# Altium schematic sheet Power_supplies_V2.SchDoc
size A4
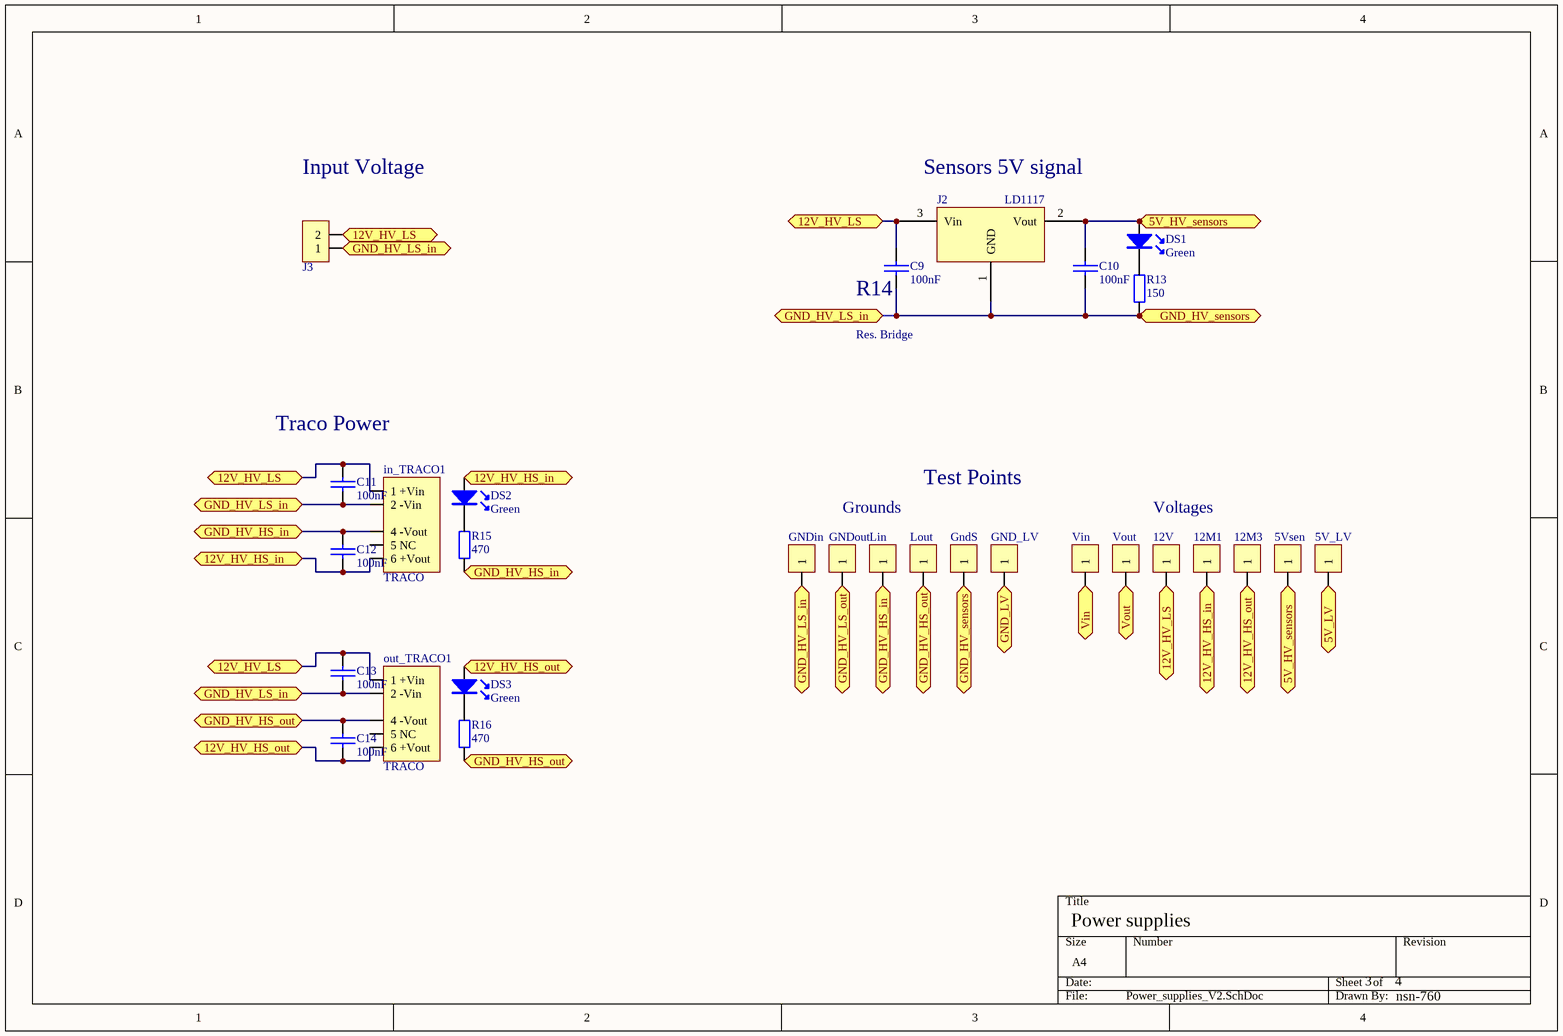
[diagram p0: Power_supplies_V2.SchDoc]

## Parts
5V_LV  Test Point  [Test_Point]  (value not drawn)
5Vsen  Test Point  [Test_Point]  (value not drawn)
12M1  Test Point  [Test_Point]  (value not drawn)
12M3  Test Point  [Test_Point]  (value not drawn)
12V  Test Point  [Test_Point]  (value not drawn)
C9  100nF  [1206]
C10  100nF  [1206]
C11  100nF  [1206]
C12  100nF  [1206]
C13  100nF  [1206]
C14  100nF  [1206]
DS1  Green  [Led 2.2mm]
DS2  Green  [Led 2.2mm]
DS3  Green  [Led 2.2mm]
GND_LV  Test Point  [Test_Point]  (value not drawn)
GNDin  Test Point  [Test_Point]  (value not drawn)
GNDout  Test Point  [Test_Point]  (value not drawn)
GndS  Test Point  [Test_Point]  (value not drawn)
in_TRACO1  TRACO  [TRACO_TMA1212S]
J2  LD1117  [SOT-223_LM1117]
J3  Cleva 2 vias  [Con2_Extron _3.5mmPitch]  (value not drawn)
Lin  Test Point  [Test_Point]  (value not drawn)
Lout  Test Point  [Test_Point]  (value not drawn)
out_TRACO1  TRACO  [TRACO_TMA1212S]
R13  150  [1206]
R14  Res. Bridge  [1206]
R15  470  [1206]
R16  470  [1206]
Vin  Test Point  [Test_Point]  (value not drawn)
Vout  Test Point  [Test_Point]  (value not drawn)

## Ports
5V_HV_sensors, 5V_LV, 12V_HV_HS_in, 12V_HV_HS_out, 12V_HV_LS, GND_HV_HS_in, GND_HV_HS_out, GND_HV_LS_in, GND_HV_LS_out, GND_HV_sensors, GND_LV, Vin, Vout

## Nets
5V_HV_sensors: 5Vsen.1 C10.2 DS1.A J2.2(Vout) ; port 5V_HV_sensors
5V_LV: 5V_LV.1 ; port 5V_LV
12V_HV_HS_in: 12M1.1 C12.1 DS2.A in_TRACO1.6(6_+Vout) ; port 12V_HV_HS_in
12V_HV_HS_out: 12M3.1 C14.1 DS3.A out_TRACO1.6(6_+Vout) ; port 12V_HV_HS_out
12V_HV_LS: 12V.1 C9.2 C11.2 C13.2 in_TRACO1.1(1_+Vin) J2.3(Vin) J3.2 out_TRACO1.1(1_+Vin) ; port 12V_HV_LS
GND_HV_HS_in: C12.2 in_TRACO1.4(4_-Vout) Lin.1 R15.2 ; port GND_HV_HS_in
GND_HV_HS_out: C14.2 Lout.1 out_TRACO1.4(4_-Vout) R16.2 ; port GND_HV_HS_out
GND_HV_LS_in: C11.1 C13.1 GNDin.1 in_TRACO1.2(2_-Vin) J3.1 out_TRACO1.2(2_-Vin) R14.1 ; port GND_HV_LS_in
GND_HV_LS_out: GNDout.1 ; port GND_HV_LS_out
GND_HV_sensors: C9.1 C10.1 GndS.1 J2.1(GND) R13.2 R14.2 ; port GND_HV_sensors
GND_LV: GND_LV.1 ; port GND_LV
Vin: Vin.1 ; port Vin
Vout: Vout.1 ; port Vout
NetDS1_K: DS1.K R13.1
NetDS2_K: DS2.K R15.1
NetDS3_K: DS3.K R16.1

Not connected (* = marked no-connect by the designer): in_TRACO1 5(5_NC); out_TRACO1 5(5_NC)

## Notes on the sheet
- Input Voltage
- Sensors 5V signal
- Traco Power
- Grounds
- Test Points
- Voltages
- Power supplies
- 3
- 4
- nsn-760

## Library data of the parts
C9-C14 = Condensador
DS1-DS3 = Led
in_TRACO1 out_TRACO1 = TRACO: TracoPower TMA1212S
J2 = LD1117: Linear voltage regulator
J3 = Con_2
R13 R15 R16 = Resistencia: Potencia: 1/4W
R14 = Res. Bridge: Resistencia Bridge